# Altium schematic sheet 6_CAN.schdoc.schdoc
size 309 x 223 mm; Symbol: Sheet-Symbol_A4; Device: Sheet-Symbol_A4; @Page Name: CAN; @Create Date: 2023-11-30; @Page Count: 6; @Page No: 3; @Project Name: STM32F722RET6; @Schematic Name: 开发板; @Update Date: 2023-11-30; Company: 嘉立创EDA; Page Size: A4; Version: V1.0
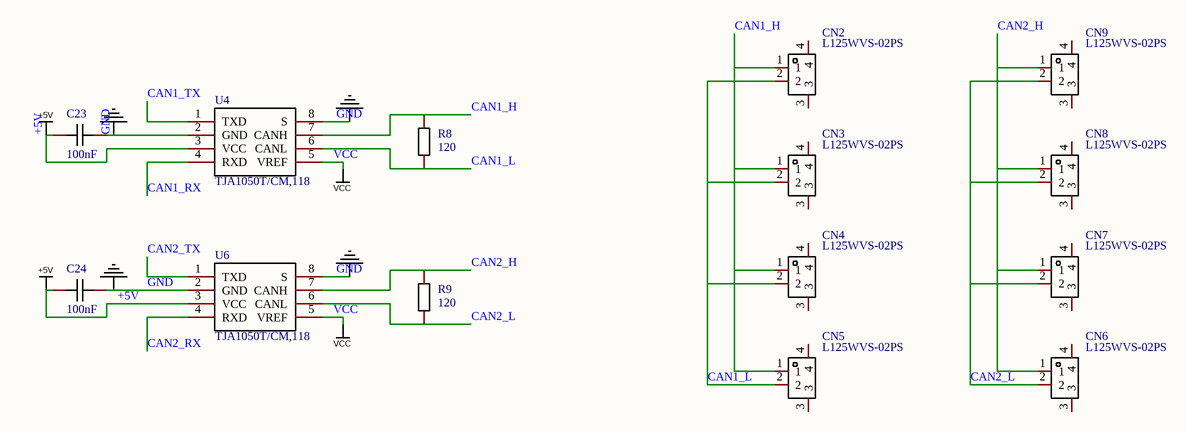
[diagram p0: 6_CAN.schdoc.schdoc]

## Parts
C23  100nF  [C0603]
C24  100nF  [C0603]
CN2  L125WVS-02PS  [CONN-SMD_2P-P1.25_L125WVS-02PS]
CN3  L125WVS-02PS  [CONN-SMD_2P-P1.25_L125WVS-02PS]
CN4  L125WVS-02PS  [CONN-SMD_2P-P1.25_L125WVS-02PS]
CN5  L125WVS-02PS  [CONN-SMD_2P-P1.25_L125WVS-02PS]
CN6  L125WVS-02PS  [CONN-SMD_2P-P1.25_L125WVS-02PS]
CN7  L125WVS-02PS  [CONN-SMD_2P-P1.25_L125WVS-02PS]
CN8  L125WVS-02PS  [CONN-SMD_2P-P1.25_L125WVS-02PS]
CN9  L125WVS-02PS  [CONN-SMD_2P-P1.25_L125WVS-02PS]
R8  120  [R0603]
R9  120  [R0603]
U4  TJA1050T/CM,118  [SOIC-8_L5.0-W4.0-P1.27-LS6.0-BL]
U6  TJA1050T/CM,118  [SOIC-8_L5.0-W4.0-P1.27-LS6.0-BL]

## Nets
+5V: C23.1 C24.1 U4.3(VCC) U6.3(VCC)
GND: C23.2 C24.2 U4.2(GND) U4.8(S) U6.2(GND) U6.8(S)
VCC: U4.5(VREF) U6.5(VREF)
CAN1_H: CN2.1 CN3.1 CN4.1 CN5.1 R8.1 U4.7(CANH)
CAN1_L: CN2.2 CN3.2 CN4.2 CN5.2 R8.2 U4.6(CANL)
CAN1_RX: U4.4(RXD)
CAN1_TX: U4.1(TXD)
CAN2_H: CN6.1 CN7.1 CN8.1 CN9.1 R9.1 U6.7(CANH)
CAN2_L: CN6.2 CN7.2 CN8.2 CN9.2 R9.2 U6.6(CANL)
CAN2_RX: U6.4(RXD)
CAN2_TX: U6.1(TXD)

Not connected (* = marked no-connect by the designer): CN2 3 4; CN3 3 4; CN4 3 4; CN5 3 4; CN6 3 4; CN7 3 4; CN8 3 4; CN9 3 4

## Notes on the sheet
- 1
- 2
- 3
- 4
- 5
- 6
- A
- B
- C
- 原理图
- 开发板
- 创建日期
- 更新日期
- 2023-11-30
- 审阅
- 绘制
- 图页
- CAN
- 物料编码
- STM32F722RET6
- D
- 版本
- 尺寸
- 页
- 共
- V1.0
- A4
- 嘉立创EDA

## Library data of the parts
C23 C24 = CAP_0603: Symbol: CapAcitance; Convert to PCB: yes; Name: 100nF; Device: CAP_0603; Add into BOM: yes; Supplier Footprint: 0603; Value: 100nF
CN2-CN9 = L125WVS-02PS: 插针结构:1x2P;间距:1.25mm;公母:公;安装方式:立贴;排数:1;每排PIN数:2;额定电流:1A;工作温度范围:-40℃~+110℃;; Manufacturer: DEALON(德艺隆); Add into BOM: yes; Pins Structure: 1x2P; Pitch: 1.25mm; Gender: 公; Number of PINs Per Row: 2; Current Rating (Max): 1A; Name: L125WVS-02PS; Symbol: L125WVS-02PS; Device: L125WVS-02PS; LCSC Part Name: 1x2P 间距:1.25mm 立贴 GH1.25间距立式贴片 2P 连接器; Supplier Part: C2998795; Manufacturer Part: L125WVS-02PS; Supplier Footprint: SMD,P=1.25mm; JLCPCB Part Class: Extended Part; Datasheet: https://atta.szlcsc.com/upload/public/pdf/source/20220425/F8C01F9CB8873697297E333D30B44EFA.pdf; Supplier: LCSC; Convert to PCB: yes; Mounting Style: 立贴; Number of Rows: 1; Operating Temperature Range: -40℃~+110℃
R8 R9 = Res_0603: Symbol: 电阻; Convert to PCB: yes; Name: 120; Device: Res_0603; Add into BOM: yes; Supplier Footprint: 0603; Value: 120
U4 U6 = TJA1050T/CM,118: 类型:收发器;; Manufacturer: NXP(恩智浦); Add into BOM: yes; Supply Voltage: 4.75V~5.25V; Supply Current: 50mA; Name: TJA1050T/CM,118; Symbol: TJA1050T/CM,118; Device: TJA1050T/CM,118; LCSC Part Name: 4.75V~5.25V; Supplier Part: C6952; Manufacturer Part: TJA1050T/CM,118; Supplier Footprint: SOIC-8; JLCPCB Part Class: 扩展库; Datasheet: https://atta.szlcsc.com/upload/public/pdf/source/20140411/1457707042917.pdf; Supplier: LCSC; Convert to PCB: yes; Type: 收发器